# Altium schematic sheet C_76p593.SchDoc
size A4; Organization: Medical Technologies CZ a.s.; SheetNumber: 5; SheetTotal: 9; Version1: N/A; Version2: N/A; Version3: N/A; Change1description: N/A; Change2description: N/A; Change3description: N/A; Change1DrawnBy: N/A; Change2DrawnBy: N/A; Change3DrawnBy: N/A; Change1CheckedBy: N/A; Change2CheckedBy: N/A; Change3CheckedBy: N/A; PreviusVersion_Chng1: N/A; PreviusVersion_Chng2: N/A; PreviusVersion_Chng3: N/A; Variant1description: Standard assembly; Variant2description: N/A; Variant3description: N/A; Variant4description: N/A; PrimaryCard1: XXXxxxXXX; PrimaryCard2: N/A; PrimaryCard3: N/A; PrimaryCard4: N/A; DocumentName: Docname
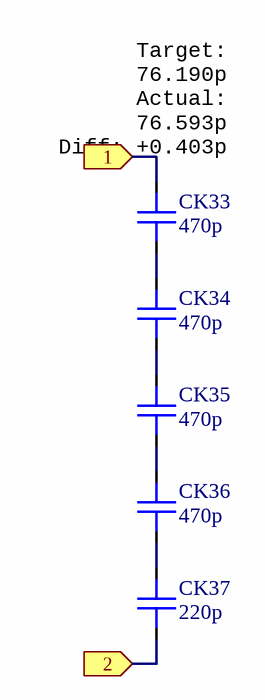
[diagram p0: C_76p593.SchDoc]

## Parts
CK33  470p  [CAPC1005X06N(SMC0402)]
CK34  470p  [CAPC1005X06N(SMC0402)]
CK35  470p  [CAPC1005X06N(SMC0402)]
CK36  470p  [CAPC1005X06N(SMC0402)]
CK37  220p  [CAPC1005X06N(SMC0402)]

## Ports
1 (in), 2 (in)

## Nets
1: CK33.1 ; port 1
2: CK37.2 ; port 2
NetCK33_2: CK33.2 CK34.1
NetCK34_2: CK34.2 CK35.1
NetCK35_2: CK35.2 CK36.1
NetCK36_2: CK36.2 CK37.1

## Notes on the sheet
- (near CK33) Target: 76.190p
  Actual: 76.593p
  Diff: +0.403p
- Číslo výkresu /drawing number/:
- Nazev listu/sheet name/:
- DPS projekt/PCB project/:
- Kreslil /drawn by/ :
- Kontroloval /checked by/:
- Datum /date/:
- List /sheet/:
- /

## Library data of the parts
CK33-CK36 = ECK+470P50V0402XX0: C; 470p; 50V; 1%; NP0/C0G; ??;; Manufacturer: Kemet: C0402C471F5GAC7867;;Murata: GRM1555C1H471FA01D; Component_Class: Capacitor; Status_I: Production; Status_II: Active; Tolerance_Pct: 1; Voltage_Rating_V: 50; Capacitance_F: 4.7E-10; KK: ECK+470P50V0402XX0; Value: 470p; SMD: 1; ComponentLink2URL: I:\DataSheets\ECK+470P50V0402XX0_KemetEN100.pdf; ComponentLink2Description: ECK+470P50V0402XX0_KemetEN100.pdf; ComponentLink3URL: I:\DataSheets\ECK+470P50V0402XX0_MurataEN100.pdf; ComponentLink3Description: ECK+470P50V0402XX0_MurataEN100.pdf; ComponentLink4URL: i:\DataSheets\ECK+470P50V0402XX0_2_KemetEN100.pdf; ComponentLink4Description: ECK+470P50V0402XX0_2_KemetEN100.pdf; ComponentLink5URL: i:\DataSheets\ECK+470P50V0402XX0_2_MurataEN100.pdf; ComponentLink5Description: ECK+470P50V0402XX0_2_MurataEN100.pdf; Dielectric_Type: NP0/C0G; ComponentLink1URL: heliosgreen://v1/hegMT/5-MT/Classes(343)/Folders/OpenForm?RecordNumbers=[14965054]; ComponentLink1Description: Helios
CK37 = ECK+220P50V0402XX0: C; 220p; 50V; 1%; NP0/C0G; ??;; Manufacturer: YAGEO: CC0402FRNPO9BN221; Component_Class: Capacitor; Status_I: Production; Status_II: Active; Tolerance_Pct: 1; Voltage_Rating_V: 50; Capacitance_F: 2.2E-10; KK: ECK+220P50V0402XX0; Value: 220p; SMD: 1; ComponentLink2URL: I:\DataSheets\ECK+220P50V0402XX0_YAGEO_NP0_EN100.pdf; ComponentLink2Description: ECK+220P50V0402XX0_YAGEO_NP0_EN100.pdf; ComponentLink3URL: i:\DataSheets\ECK+220P50V0402XX0_2_YageoEN100.pdf; ComponentLink3Description: ECK+220P50V0402XX0_2_YageoEN100.pdf; Dielectric_Type: NP0/C0G; ComponentLink1URL: heliosgreen://v1/hegMT/5-MT/Classes(343)/Folders/OpenForm?RecordNumbers=[15269853]; ComponentLink1Description: Helios